# Altium schematic sheet DivergentSignalOffset.SchDoc
size A
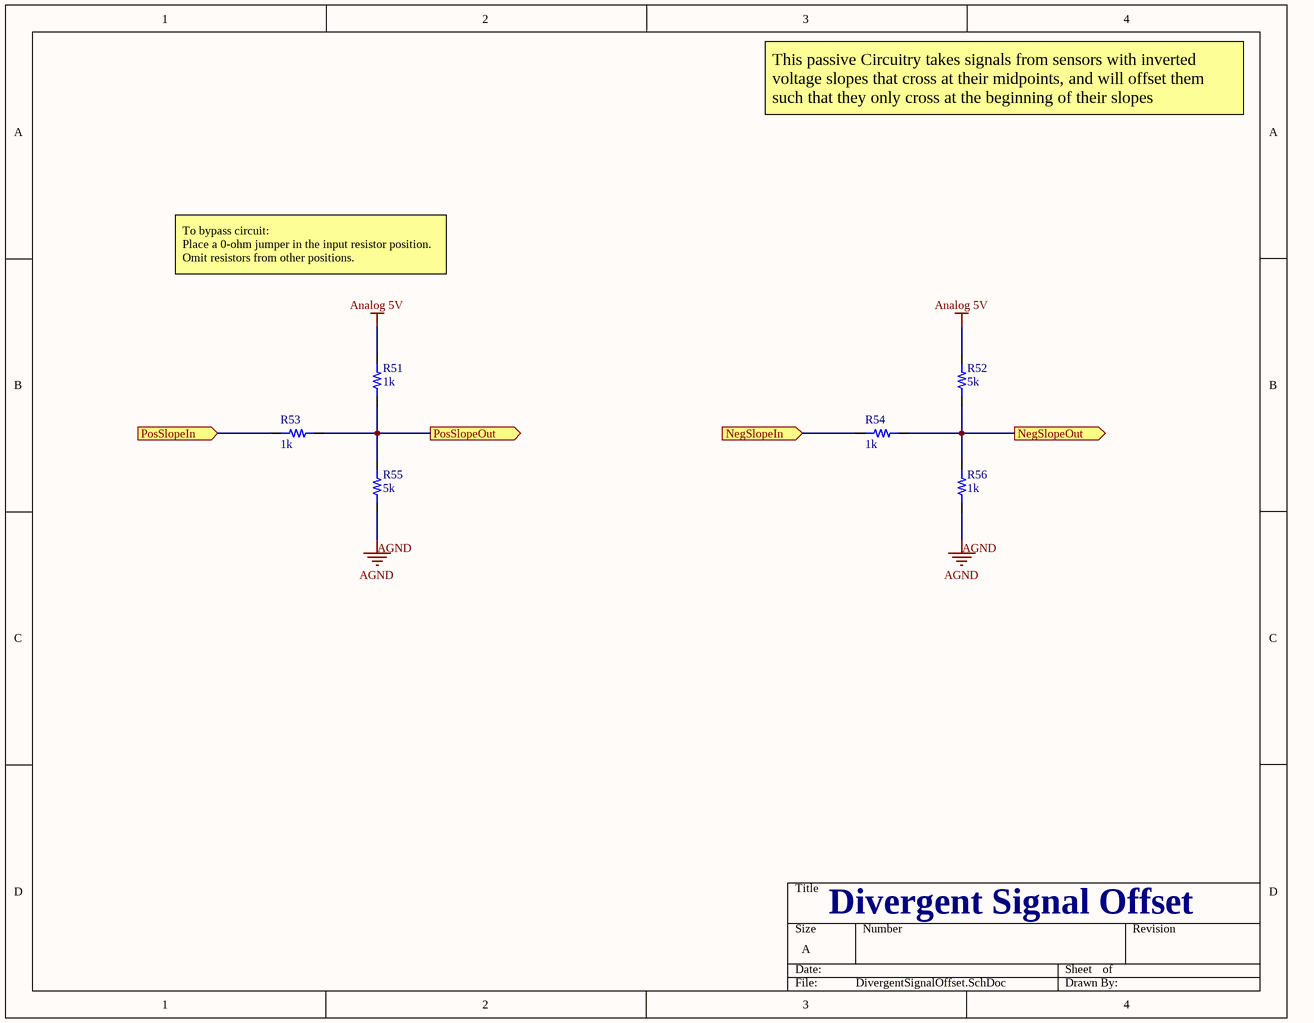
[diagram p0: DivergentSignalOffset.SchDoc]

## Parts
R51  resistance: 1k  [0603]  (hidden comment: resistor)
R52  resistance: 5k  [0603]  (hidden comment: resistor)
R53  resistance: 1k  [0603]  (hidden comment: resistor)
R54  resistance: 1k  [0603]  (hidden comment: resistor)
R55  resistance: 5k  [0603]  (hidden comment: resistor)
R56  resistance: 1k  [0603]  (hidden comment: resistor)

## Ports
NegSlopeIn (in), NegSlopeOut (out), PosSlopeIn (in), PosSlopeOut (out)

## Nets
AGND: R55.1 R56.1
Analog 5V: R51.2 R52.2
NegSlopeIn: R54.1 ; port NegSlopeIn
NegSlopeOut: R52.1 R54.2 R56.2 ; port NegSlopeOut
PosSlopeIn: R53.1 ; port PosSlopeIn
PosSlopeOut: R51.1 R53.2 R55.2 ; port PosSlopeOut

## Notes on the sheet
- This passive Circuitry takes signals from sensors with inverted voltage slopes that cross at their midpoints, and will offset them such that they only cross at the beginning of their slopes
- To bypass circuit:
  Place a 0-ohm jumper in the input resistor position. Omit resistors from other positions.
- Divergent Signal Offset

## Library data of the parts
R51-R56 = 1: id: 1; name: 0603 Resistor; percent tolerance: 5; package: 0603; quantity: 0